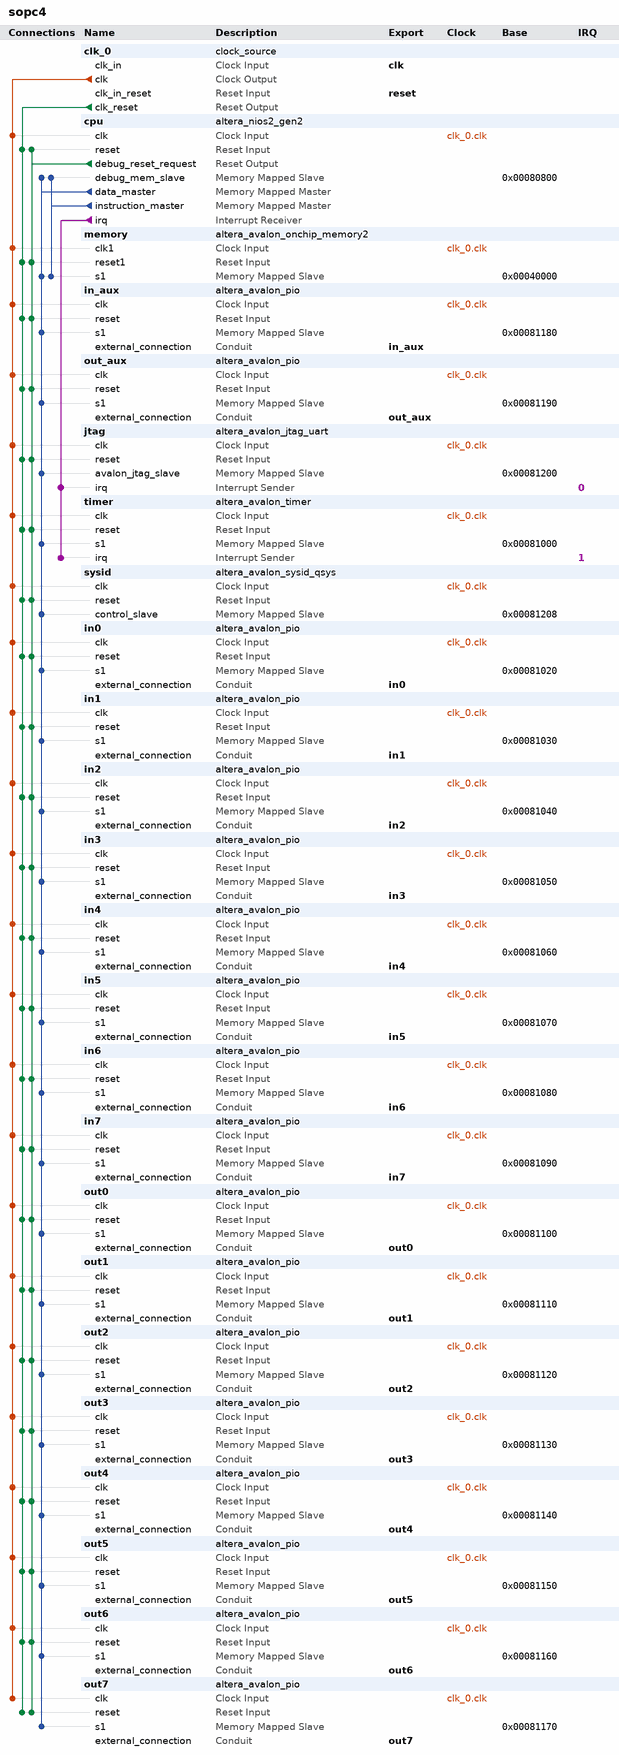
[diagram p0: system contents]
# Platform Designer (Qsys) system sopc4, Cyclone V 5CSEMA5F31C6
# Parameters at their usual value, and those the tool derives, are not listed.
package require -exact qsys 18.0
create_system sopc4
set_project_property DEVICE_FAMILY {Cyclone V}
set_project_property DEVICE 5CSEMA5F31C6

add_instance clk_0 clock_source 18.0
set_instance_parameter_value clk_0 clockFrequency 50000000

add_instance cpu altera_nios2_gen2 18.0
set_instance_parameter_value cpu dcache_size 2048
set_instance_parameter_value cpu exceptionSlave memory.s1
set_instance_parameter_value cpu icache_size 4096
set_instance_parameter_value cpu impl Fast
set_instance_parameter_value cpu resetSlave memory.s1

add_instance memory altera_avalon_onchip_memory2 18.0
set_instance_parameter_value memory dataWidth 32
set_instance_parameter_value memory dualPort false
set_instance_parameter_value memory initMemContent true
set_instance_parameter_value memory initializationFileName onchip_mem.hex
set_instance_parameter_value memory memorySize 204800

add_instance in_aux altera_avalon_pio 18.0
set_instance_parameter_value in_aux direction Input
set_instance_parameter_value in_aux width 8

add_instance out_aux altera_avalon_pio 18.0
set_instance_parameter_value out_aux direction Output
set_instance_parameter_value out_aux width 8

add_instance jtag altera_avalon_jtag_uart 18.0
set_instance_parameter_value jtag simInteractiveOptions NO_INTERACTIVE_WINDOWS

add_instance timer altera_avalon_timer 18.0
set_instance_parameter_value timer period 1
set_instance_parameter_value timer periodUnits SEC

add_instance sysid altera_avalon_sysid_qsys 18.0
set_instance_parameter_value sysid id 0

add_instance in0 altera_avalon_pio 18.0
set_instance_parameter_value in0 direction Input
set_instance_parameter_value in0 width 8

add_instance in1 altera_avalon_pio 18.0
set_instance_parameter_value in1 direction Input
set_instance_parameter_value in1 width 8

add_instance in2 altera_avalon_pio 18.0
set_instance_parameter_value in2 direction Input
set_instance_parameter_value in2 width 8

add_instance in3 altera_avalon_pio 18.0
set_instance_parameter_value in3 direction Input
set_instance_parameter_value in3 width 8

add_instance in4 altera_avalon_pio 18.0
set_instance_parameter_value in4 direction Input
set_instance_parameter_value in4 width 8

add_instance in5 altera_avalon_pio 18.0
set_instance_parameter_value in5 direction Input
set_instance_parameter_value in5 width 8

add_instance in6 altera_avalon_pio 18.0
set_instance_parameter_value in6 direction Input
set_instance_parameter_value in6 width 8

add_instance in7 altera_avalon_pio 18.0
set_instance_parameter_value in7 direction Input
set_instance_parameter_value in7 width 8

add_instance out0 altera_avalon_pio 18.0
set_instance_parameter_value out0 direction Output
set_instance_parameter_value out0 width 8

add_instance out1 altera_avalon_pio 18.0
set_instance_parameter_value out1 direction Output
set_instance_parameter_value out1 width 8

add_instance out2 altera_avalon_pio 18.0
set_instance_parameter_value out2 direction Output
set_instance_parameter_value out2 width 8

add_instance out3 altera_avalon_pio 18.0
set_instance_parameter_value out3 direction Output
set_instance_parameter_value out3 width 8

add_instance out4 altera_avalon_pio 18.0
set_instance_parameter_value out4 direction Output
set_instance_parameter_value out4 width 8

add_instance out5 altera_avalon_pio 18.0
set_instance_parameter_value out5 direction Output
set_instance_parameter_value out5 width 8

add_instance out6 altera_avalon_pio 18.0
set_instance_parameter_value out6 direction Output
set_instance_parameter_value out6 width 8

add_instance out7 altera_avalon_pio 18.0
set_instance_parameter_value out7 direction Output
set_instance_parameter_value out7 width 8

# connections
add_connection clk_0.clk cpu.clk clock
add_connection clk_0.clk in0.clk clock
add_connection clk_0.clk in1.clk clock
add_connection clk_0.clk in2.clk clock
add_connection clk_0.clk in3.clk clock
add_connection clk_0.clk in4.clk clock
add_connection clk_0.clk in5.clk clock
add_connection clk_0.clk in6.clk clock
add_connection clk_0.clk in7.clk clock
add_connection clk_0.clk in_aux.clk clock
add_connection clk_0.clk jtag.clk clock
add_connection clk_0.clk memory.clk1 clock
add_connection clk_0.clk out0.clk clock
add_connection clk_0.clk out1.clk clock
add_connection clk_0.clk out2.clk clock
add_connection clk_0.clk out3.clk clock
add_connection clk_0.clk out4.clk clock
add_connection clk_0.clk out5.clk clock
add_connection clk_0.clk out6.clk clock
add_connection clk_0.clk out7.clk clock
add_connection clk_0.clk out_aux.clk clock
add_connection clk_0.clk sysid.clk clock
add_connection clk_0.clk timer.clk clock
add_connection clk_0.clk_reset cpu.reset reset
add_connection clk_0.clk_reset in0.reset reset
add_connection clk_0.clk_reset in1.reset reset
add_connection clk_0.clk_reset in2.reset reset
add_connection clk_0.clk_reset in3.reset reset
add_connection clk_0.clk_reset in4.reset reset
add_connection clk_0.clk_reset in5.reset reset
add_connection clk_0.clk_reset in6.reset reset
add_connection clk_0.clk_reset in7.reset reset
add_connection clk_0.clk_reset in_aux.reset reset
add_connection clk_0.clk_reset jtag.reset reset
add_connection clk_0.clk_reset memory.reset1 reset
add_connection clk_0.clk_reset out0.reset reset
add_connection clk_0.clk_reset out1.reset reset
add_connection clk_0.clk_reset out2.reset reset
add_connection clk_0.clk_reset out3.reset reset
add_connection clk_0.clk_reset out4.reset reset
add_connection clk_0.clk_reset out5.reset reset
add_connection clk_0.clk_reset out6.reset reset
add_connection clk_0.clk_reset out7.reset reset
add_connection clk_0.clk_reset out_aux.reset reset
add_connection clk_0.clk_reset sysid.reset reset
add_connection clk_0.clk_reset timer.reset reset
add_connection cpu.debug_reset_request cpu.reset reset
add_connection cpu.debug_reset_request in0.reset reset
add_connection cpu.debug_reset_request in1.reset reset
add_connection cpu.debug_reset_request in2.reset reset
add_connection cpu.debug_reset_request in3.reset reset
add_connection cpu.debug_reset_request in4.reset reset
add_connection cpu.debug_reset_request in5.reset reset
add_connection cpu.debug_reset_request in6.reset reset
add_connection cpu.debug_reset_request in7.reset reset
add_connection cpu.debug_reset_request in_aux.reset reset
add_connection cpu.debug_reset_request jtag.reset reset
add_connection cpu.debug_reset_request memory.reset1 reset
add_connection cpu.debug_reset_request out0.reset reset
add_connection cpu.debug_reset_request out1.reset reset
add_connection cpu.debug_reset_request out2.reset reset
add_connection cpu.debug_reset_request out3.reset reset
add_connection cpu.debug_reset_request out4.reset reset
add_connection cpu.debug_reset_request out5.reset reset
add_connection cpu.debug_reset_request out6.reset reset
add_connection cpu.debug_reset_request out7.reset reset
add_connection cpu.debug_reset_request out_aux.reset reset
add_connection cpu.debug_reset_request sysid.reset reset
add_connection cpu.debug_reset_request timer.reset reset
add_connection cpu.data_master cpu.debug_mem_slave avalon
set_connection_parameter_value cpu.data_master/cpu.debug_mem_slave baseAddress 0x00080800
add_connection cpu.data_master in0.s1 avalon
set_connection_parameter_value cpu.data_master/in0.s1 baseAddress 0x00081020
add_connection cpu.data_master in1.s1 avalon
set_connection_parameter_value cpu.data_master/in1.s1 baseAddress 0x00081030
add_connection cpu.data_master in2.s1 avalon
set_connection_parameter_value cpu.data_master/in2.s1 baseAddress 0x00081040
add_connection cpu.data_master in3.s1 avalon
set_connection_parameter_value cpu.data_master/in3.s1 baseAddress 0x00081050
add_connection cpu.data_master in4.s1 avalon
set_connection_parameter_value cpu.data_master/in4.s1 baseAddress 0x00081060
add_connection cpu.data_master in5.s1 avalon
set_connection_parameter_value cpu.data_master/in5.s1 baseAddress 0x00081070
add_connection cpu.data_master in6.s1 avalon
set_connection_parameter_value cpu.data_master/in6.s1 baseAddress 0x00081080
add_connection cpu.data_master in7.s1 avalon
set_connection_parameter_value cpu.data_master/in7.s1 baseAddress 0x00081090
add_connection cpu.data_master in_aux.s1 avalon
set_connection_parameter_value cpu.data_master/in_aux.s1 baseAddress 0x00081180
add_connection cpu.data_master jtag.avalon_jtag_slave avalon
set_connection_parameter_value cpu.data_master/jtag.avalon_jtag_slave baseAddress 0x00081200
add_connection cpu.data_master memory.s1 avalon
set_connection_parameter_value cpu.data_master/memory.s1 baseAddress 0x00040000
add_connection cpu.data_master out0.s1 avalon
set_connection_parameter_value cpu.data_master/out0.s1 baseAddress 0x00081100
add_connection cpu.data_master out1.s1 avalon
set_connection_parameter_value cpu.data_master/out1.s1 baseAddress 0x00081110
add_connection cpu.data_master out2.s1 avalon
set_connection_parameter_value cpu.data_master/out2.s1 baseAddress 0x00081120
add_connection cpu.data_master out3.s1 avalon
set_connection_parameter_value cpu.data_master/out3.s1 baseAddress 0x00081130
add_connection cpu.data_master out4.s1 avalon
set_connection_parameter_value cpu.data_master/out4.s1 baseAddress 0x00081140
add_connection cpu.data_master out5.s1 avalon
set_connection_parameter_value cpu.data_master/out5.s1 baseAddress 0x00081150
add_connection cpu.data_master out6.s1 avalon
set_connection_parameter_value cpu.data_master/out6.s1 baseAddress 0x00081160
add_connection cpu.data_master out7.s1 avalon
set_connection_parameter_value cpu.data_master/out7.s1 baseAddress 0x00081170
add_connection cpu.data_master out_aux.s1 avalon
set_connection_parameter_value cpu.data_master/out_aux.s1 baseAddress 0x00081190
add_connection cpu.data_master sysid.control_slave avalon
set_connection_parameter_value cpu.data_master/sysid.control_slave baseAddress 0x00081208
add_connection cpu.data_master timer.s1 avalon
set_connection_parameter_value cpu.data_master/timer.s1 baseAddress 0x00081000
add_connection cpu.instruction_master cpu.debug_mem_slave avalon
set_connection_parameter_value cpu.instruction_master/cpu.debug_mem_slave baseAddress 0x00080800
add_connection cpu.instruction_master memory.s1 avalon
set_connection_parameter_value cpu.instruction_master/memory.s1 baseAddress 0x00040000
add_connection cpu.irq jtag.irq interrupt
set_connection_parameter_value cpu.irq/jtag.irq irqNumber 0
add_connection cpu.irq timer.irq interrupt
set_connection_parameter_value cpu.irq/timer.irq irqNumber 1

# exported interfaces
add_interface clk clock sink
set_interface_property clk EXPORT_OF clk_0.clk_in
add_interface in0 conduit end
set_interface_property in0 EXPORT_OF in0.external_connection
add_interface in1 conduit end
set_interface_property in1 EXPORT_OF in1.external_connection
add_interface in2 conduit end
set_interface_property in2 EXPORT_OF in2.external_connection
add_interface in3 conduit end
set_interface_property in3 EXPORT_OF in3.external_connection
add_interface in4 conduit end
set_interface_property in4 EXPORT_OF in4.external_connection
add_interface in5 conduit end
set_interface_property in5 EXPORT_OF in5.external_connection
add_interface in6 conduit end
set_interface_property in6 EXPORT_OF in6.external_connection
add_interface in7 conduit end
set_interface_property in7 EXPORT_OF in7.external_connection
add_interface in_aux conduit end
set_interface_property in_aux EXPORT_OF in_aux.external_connection
add_interface out0 conduit end
set_interface_property out0 EXPORT_OF out0.external_connection
add_interface out1 conduit end
set_interface_property out1 EXPORT_OF out1.external_connection
add_interface out2 conduit end
set_interface_property out2 EXPORT_OF out2.external_connection
add_interface out3 conduit end
set_interface_property out3 EXPORT_OF out3.external_connection
add_interface out4 conduit end
set_interface_property out4 EXPORT_OF out4.external_connection
add_interface out5 conduit end
set_interface_property out5 EXPORT_OF out5.external_connection
add_interface out6 conduit end
set_interface_property out6 EXPORT_OF out6.external_connection
add_interface out7 conduit end
set_interface_property out7 EXPORT_OF out7.external_connection
add_interface out_aux conduit end
set_interface_property out_aux EXPORT_OF out_aux.external_connection
add_interface reset reset sink
set_interface_property reset EXPORT_OF clk_0.clk_in_reset

set_interconnect_requirement {$system} qsys_mm.clockCrossingAdapter HANDSHAKE
set_interconnect_requirement {$system} qsys_mm.enableEccProtection FALSE
set_interconnect_requirement {$system} qsys_mm.insertDefaultSlave FALSE
set_interconnect_requirement {$system} qsys_mm.maxAdditionalLatency 1

save_system sopc4.qsys
